# Altium schematic sheet Main.SchDoc
size C; SheetNumber: 1; SheetTotal: 1; SPICEModelCacheCWOFPNVQ: <root> / <DocumentId>CWOFPNVQ</DocumentId> / <CacheFrame Number="0"> / <Model Name="cap" Kind="MDL"> / <Text>*Default semiconductor capacitor / .MODEL CAP C()</Text> / </Model> / </CacheFrame> / </root>
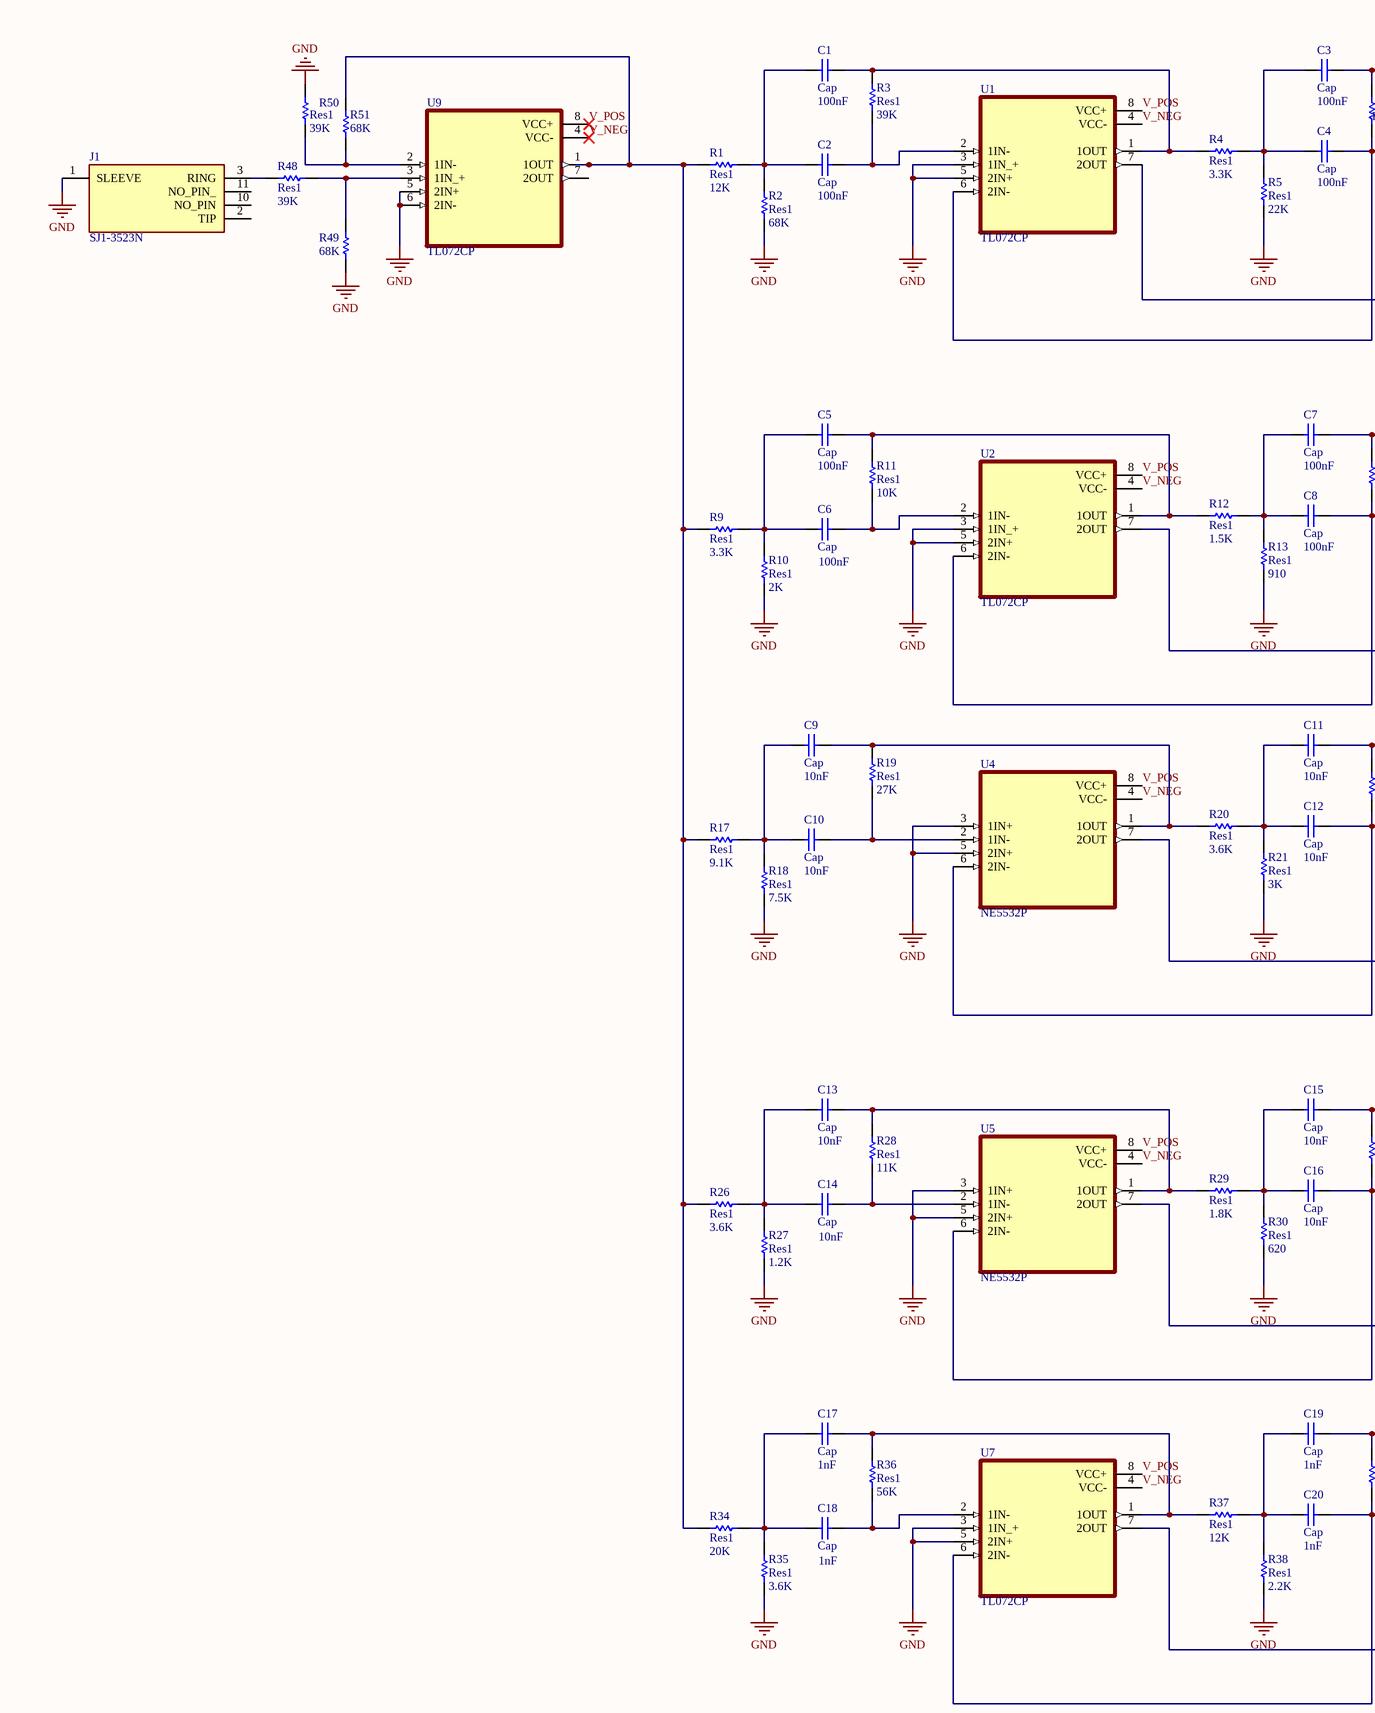
[diagram p0: Main.SchDoc, left]
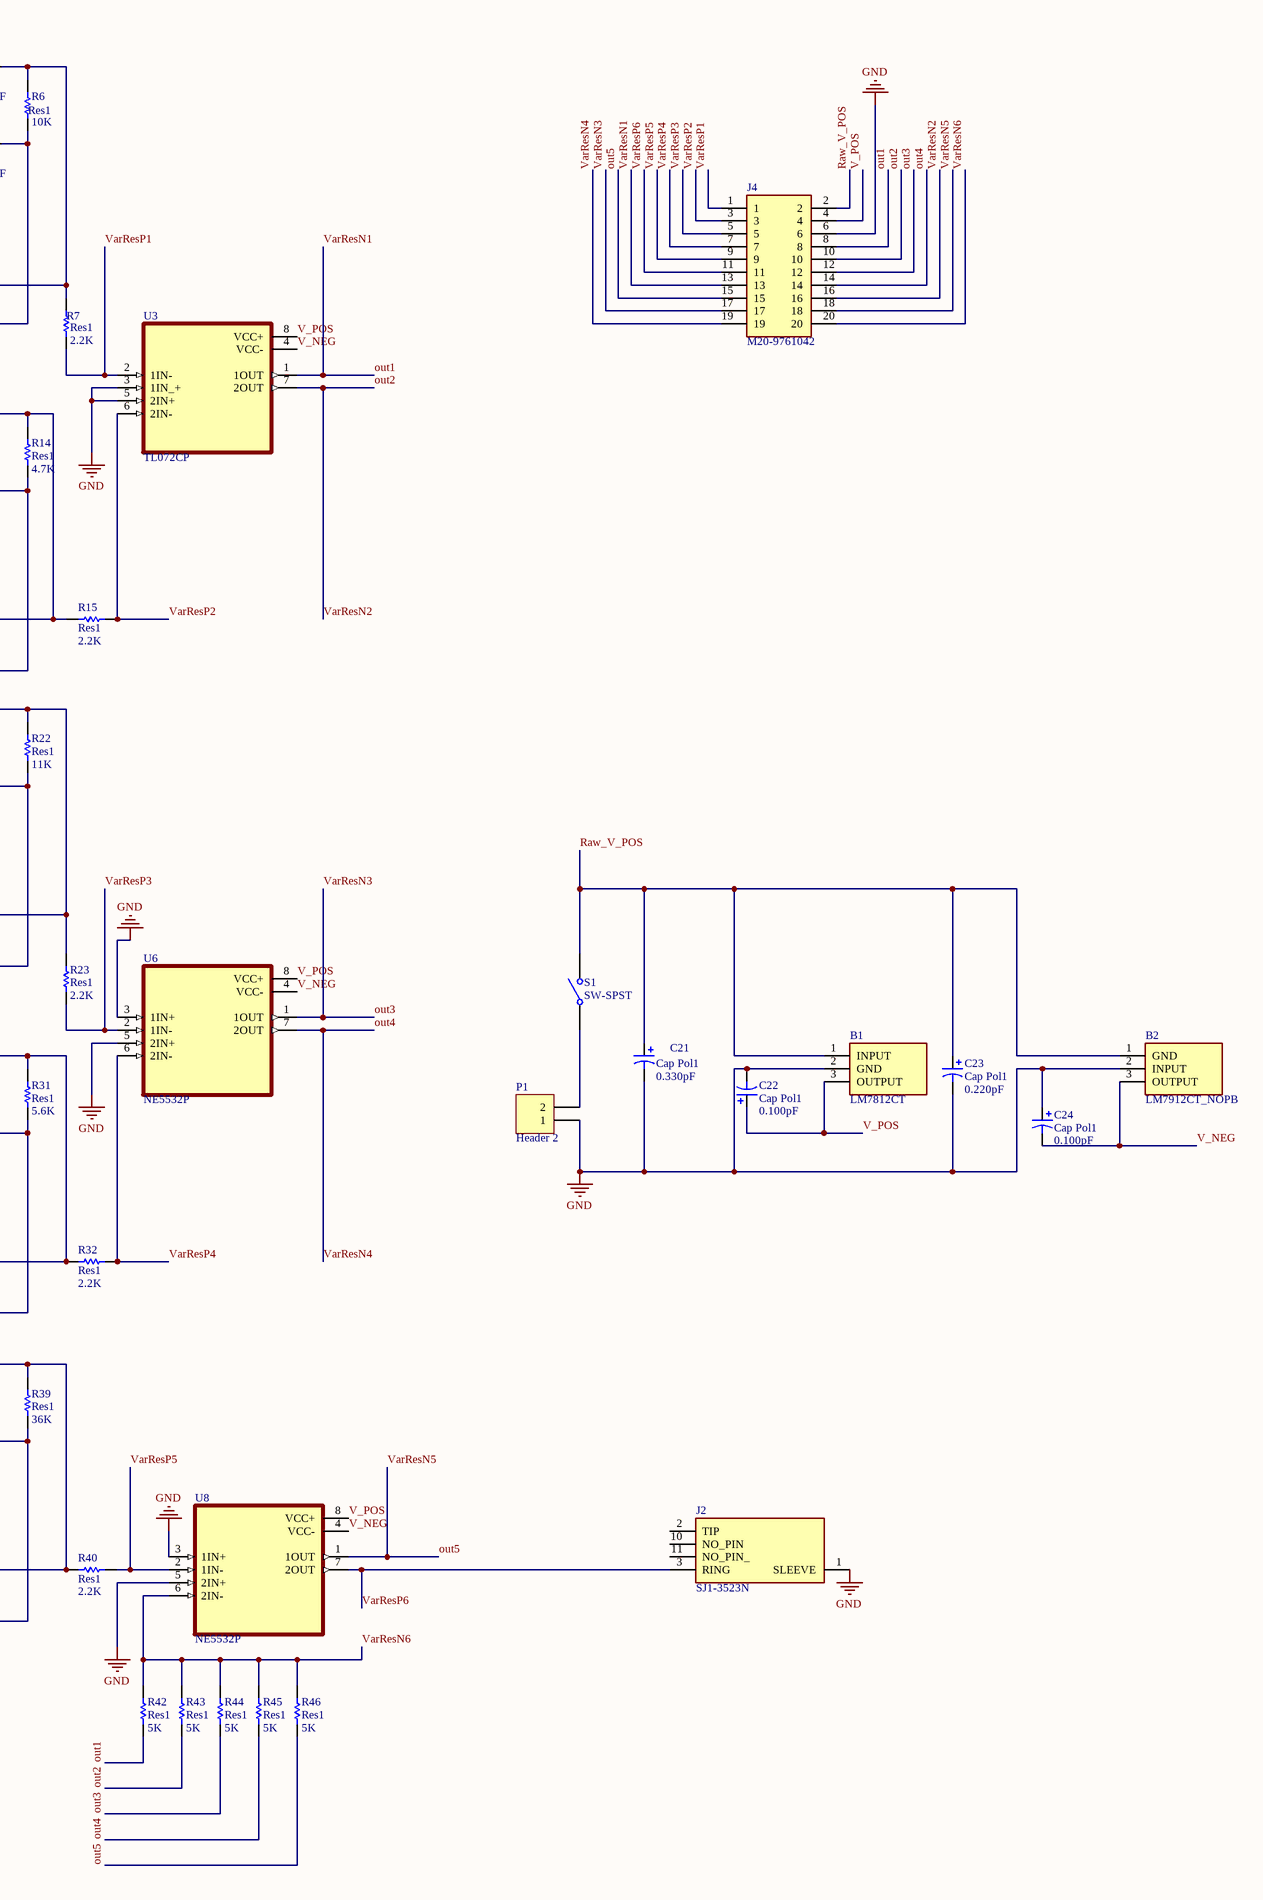
[diagram p1: Main.SchDoc, right]

## Parts
B1  LM7812CT  [TO254P470X1028X1955-3P]
B2  LM7912CT_NOPB  [TO254P470X1028X1955-3P]
C1  Cap  value 100nF  [RAD-0.3]
C2  Cap  value 100nF  [RAD-0.3]
C3  Cap  value 100nF  [RAD-0.3]
C4  Cap  value 100nF  [RAD-0.3]
C5  Cap  value 100nF  [RAD-0.3]
C6  Cap  value 100nF  [RAD-0.3]
C7  Cap  value 100nF  [RAD-0.3]
C8  Cap  value 100nF  [RAD-0.3]
C9  Cap  value 10nF  [RAD-0.3]
C10  Cap  value 10nF  [RAD-0.3]
C11  Cap  value 10nF  [RAD-0.3]
C12  Cap  value 10nF  [RAD-0.3]
C13  Cap  value 10nF  [RAD-0.3]
C14  Cap  value 10nF  [RAD-0.3]
C15  Cap  value 10nF  [RAD-0.3]
C16  Cap  value 10nF  [RAD-0.3]
C17  Cap  value 1nF  [RAD-0.3]
C18  Cap  value 1nF  [RAD-0.3]
C19  Cap  value 1nF  [RAD-0.3]
C20  Cap  value 1nF  [RAD-0.3]
C21  Cap Pol1  value 0.330pF  [RB7.6-15]
C22  Cap Pol1  value 0.100pF  [RB7.6-15]
C23  Cap Pol1  value 0.220pF  [RB7.6-15]
C24  Cap Pol1  value 0.100pF  [RB7.6-15]
J1  SJ1-3523N  [SJ13523N]
J2  SJ1-3523N  [SJ13523N]
J4  M20-9761042  [HDRV20W64P254_2X10_2540X508X838P]
P1  Header 2  [HDR1X2]
R1  Res1  value 12K  [AXIAL-0.3]
R2  Res1  value 68K  [AXIAL-0.3]
R3  Res1  value 39K  [AXIAL-0.3]
R4  Res1  value 3.3K  [AXIAL-0.3]
R5  Res1  value 22K  [AXIAL-0.3]
R6  Res1  value 10K  [AXIAL-0.3]
R7  Res1  value 2.2K  [AXIAL-0.3]
R9  Res1  value 3.3K  [AXIAL-0.3]
R10  Res1  value 2K  [AXIAL-0.3]
R11  Res1  value 10K  [AXIAL-0.3]
R12  Res1  value 1.5K  [AXIAL-0.3]
R13  Res1  value 910  [AXIAL-0.3]
R14  Res1  value 4.7K  [AXIAL-0.3]
R15  Res1  value 2.2K  [AXIAL-0.3]
R17  Res1  value 9.1K  [AXIAL-0.3]
R18  Res1  value 7.5K  [AXIAL-0.3]
R19  Res1  value 27K  [AXIAL-0.3]
R20  Res1  value 3.6K  [AXIAL-0.3]
R21  Res1  value 3K  [AXIAL-0.3]
R22  Res1  value 11K  [AXIAL-0.3]
R23  Res1  value 2.2K  [AXIAL-0.3]
R26  Res1  value 3.6K  [AXIAL-0.3]
R27  Res1  value 1.2K  [AXIAL-0.3]
R28  Res1  value 11K  [AXIAL-0.3]
R29  Res1  value 1.8K  [AXIAL-0.3]
R30  Res1  value 620  [AXIAL-0.3]
R31  Res1  value 5.6K  [AXIAL-0.3]
R32  Res1  value 2.2K  [AXIAL-0.3]
R34  Res1  value 20K  [AXIAL-0.3]
R35  Res1  value 3.6K  [AXIAL-0.3]
R36  Res1  value 56K  [AXIAL-0.3]
R37  Res1  value 12K  [AXIAL-0.3]
R38  Res1  value 2.2K  [AXIAL-0.3]
R39  Res1  value 36K  [AXIAL-0.3]
R40  Res1  value 2.2K  [AXIAL-0.3]
R42  Res1  value 5K  [AXIAL-0.3]
R43  Res1  value 5K  [AXIAL-0.3]
R44  Res1  value 5K  [AXIAL-0.3]
R45  Res1  value 5K  [AXIAL-0.3]
R46  Res1  value 5K  [AXIAL-0.3]
R48  Res1  value 39K  [AXIAL-0.3]
R49  value 68K  [AXIAL-0.3]  (hidden comment: Res1)
R50  Res1  value 39K  [AXIAL-0.3]
R51  value 68K  [AXIAL-0.3]  (hidden comment: Res1)
S1  SW-SPST  [SPST-2]
U1  TL072CP  [DIP794W45P254L959H508Q8]
U2  TL072CP  [DIP794W45P254L959H508Q8]
U3  TL072CP  [DIP794W45P254L959H508Q8]
U4  NE5532P  [DIP794W45P254L959H508Q8]
U5  NE5532P  [DIP794W45P254L959H508Q8]
U6  NE5532P  [DIP794W45P254L959H508Q8]
U7  TL072CP  [DIP794W45P254L959H508Q8]
U8  NE5532P  [DIP794W45P254L959H508Q8]
U9  TL072CP  [DIP794W45P254L959H508Q8]

## Nets
GND: B1.2(GND) B2.2(INPUT) C21.2 C22.2 C23.2 C24.1 J1.1(SLEEVE) J2.1(SLEEVE) J4.6 P1.1 R2.1 R5.1 R10.1 R13.1 R18.1 R21.1 R27.1 R30.1 R35.1 R38.1 R49.2 R50.2 U1.3(1IN_+) U1.5(2IN+) U2.3(1IN_+) U2.5(2IN+) U3.3(1IN_+) U3.5(2IN+) U4.3(1IN+) U4.5(2IN+) U5.3(1IN+) U5.5(2IN+) U6.3(1IN+) U6.5(2IN+) U7.3(1IN_+) U7.5(2IN+) U8.3(1IN+) U8.5(2IN+) U9.5(2IN+) U9.6(2IN-)
out1: J4.8 J4.13 R42.1 U3.1(1OUT)  [also labelled VarResN1]
out2: J4.10 J4.16 R43.1 U3.7(2OUT)  [also labelled VarResN2]
out3: J4.12 J4.17 R44.1 U6.1(1OUT)  [also labelled VarResN3]
out4: J4.14 J4.19 R45.1 U6.7(2OUT)  [also labelled VarResN4]
out5: J4.15 J4.18 R46.1 U8.1(1OUT)  [also labelled VarResN5]
Raw_V_POS: B1.1(INPUT) B2.1(GND) C21.1 C23.1 J4.2 S1.2(NO)
V_NEG: B2.3(OUTPUT) C24.2 U1.4(VCC-) U2.4(VCC-) U3.4(VCC-) U4.4(VCC-) U5.4(VCC-) U6.4(VCC-) U7.4(VCC-) U8.4(VCC-) U9.4(VCC-)
V_POS: B1.3(OUTPUT) C22.1 J4.4 U1.8(VCC+) U2.8(VCC+) U3.8(VCC+) U4.8(VCC+) U5.8(VCC+) U6.8(VCC+) U7.8(VCC+) U8.8(VCC+) U9.8(VCC+)
VarResN6: J4.20 R42.2 R43.2 R44.2 R45.2 R46.2 U8.6(2IN-)
VarResP1: J4.1 R7.1 U3.2(1IN-)
VarResP2: J4.3 R15.2 U3.6(2IN-)
VarResP3: J4.5 R23.1 U6.2(1IN-)
VarResP4: J4.7 R32.1 U6.6(2IN-)
VarResP5: J4.9 R40.1 U8.2(1IN-)
VarResP6: J2.3(RING) J4.11 U8.7(2OUT)
NetC1_1: C1.1 C2.1 R1.2 R2.2
NetC1_2: C1.2 R3.2 R4.1 U1.1(1OUT)
NetC2_2: C2.2 R3.1 U1.2(1IN-)
NetC3_1: C3.1 C4.1 R4.2 R5.2
NetC3_2: C3.2 R6.2 R7.2 U1.7(2OUT)
NetC4_2: C4.2 R6.1 U1.6(2IN-)
NetC5_1: C5.1 C6.1 R9.1 R10.2
NetC5_2: C5.2 R11.2 R12.2 U2.1(1OUT)
NetC6_2: C6.2 R11.1 U2.2(1IN-)
NetC7_1: C7.1 C8.1 R12.1 R13.2
NetC7_2: C7.2 R14.2 R15.1 U2.7(2OUT)
NetC8_2: C8.2 R14.1 U2.6(2IN-)
NetC9_1: C9.1 C10.1 R17.2 R18.2
NetC9_2: C9.2 R19.2 R20.1 U4.1(1OUT)
NetC10_2: C10.2 R19.1 U4.2(1IN-)
NetC11_1: C11.1 C12.1 R20.2 R21.2
NetC11_2: C11.2 R22.2 R23.2 U4.7(2OUT)
NetC12_2: C12.2 R22.1 U4.6(2IN-)
NetC13_1: C13.1 C14.1 R26.2 R27.2
NetC13_2: C13.2 R28.2 R29.1 U5.1(1OUT)
NetC14_2: C14.2 R28.1 U5.2(1IN-)
NetC15_1: C15.1 C16.1 R29.2 R30.2
NetC15_2: C15.2 R31.2 R32.2 U5.7(2OUT)
NetC16_2: C16.2 R31.1 U5.6(2IN-)
NetC17_1: C17.1 C18.1 R34.2 R35.2
NetC17_2: C17.2 R36.2 R37.1 U7.1(1OUT)
NetC18_2: C18.2 R36.1 U7.2(1IN-)
NetC19_1: C19.1 C20.1 R37.2 R38.2
NetC19_2: C19.2 R39.1 R40.2 U7.7(2OUT)
NetC20_2: C20.2 R39.2 U7.6(2IN-)
NetJ1_3: J1.3(RING) R48.1
NetP1_2: P1.2 S1.1(COMMON)
NetR1_1: R1.1 R9.2 R17.1 R26.1 R34.1 R51.2 U9.1(1OUT)
NetR48_2: R48.2 R49.1 U9.3(1IN_+)
NetR50_1: R50.1 R51.1 U9.2(1IN-)

Not connected (* = marked no-connect by the designer): J1 2(TIP) 10(NO_PIN) 11(NO_PIN_); J2 2(TIP) 10(NO_PIN) 11(NO_PIN_); U9 7(2OUT)

## Library data of the parts
B1 = LM7812CT: TO220 voltage regulator,LM7812CT 12V 1A; Manufacturer_Name: Texas Instruments; Geometry.Height: 4.7mm; Manufacturer_Part_Number: LM7812CT; Mouser Part Number: 926-LM7812CT; Mouser Price/Stock: https://www.mouser.co.uk/ProductDetail/Texas-Instruments/LM7812CT?qs=QbsRYf82W3EQj7KGft8TFg%3D%3D; Arrow Part Number: *; Arrow Price/Stock: *; Mouser Testing Part Number: *; Mouser Testing Price/Stock: *; Datasheet Link: http://www.ti.com/lit/ds/symlink/lm7800.pdf
B2 = LM7912CT_NOPB: Texas Instruments LM7912CT/NOPB, Single Negative Voltage Regulator 1.5A -12 V, +/-4%, 3-Pin TO-220; Geometry.Height: 4.7mm; Manufacturer_Name: Texas Instruments; Manufacturer_Part_Number: LM7912CT/NOPB; Mouser Part Number: 926-LM7912CT/NOPB; Mouser Price/Stock: https://www.mouser.co.uk/ProductDetail/Texas-Instruments/LM7912CT-NOPB?qs=QbsRYf82W3GCP0%2FQjKEJfQ%3D%3D; Arrow Part Number: LM7912CT/NOPB; Arrow Price/Stock: https://www.arrow.com/en/products/lm7912ctnopb/texas-instruments?region=nac; Mouser Testing Part Number: *; Mouser Testing Price/Stock: *; Datasheet Link: http://www.ti.com/lit/gpn/lm79
C1-C20 = Cap: Capacitor; Published: 8-Jun-2000; LatestRevisionDate: 17-Jul-2002; LatestRevisionNote: Re-released for DXP Platform.; PackageReference: RAD-0.3; Publisher: Altium Limited; PackageDescription: Radial Cap, Thru-Hole; 2 Leads; 0.3 in Pin Spacing
C21-C24 = Cap Pol1: Polarized Capacitor (Radial); Published: 8-Jun-2000; LatestRevisionDate: 17-Jul-2002; LatestRevisionNote: Re-released for DXP Platform.; PackageReference: RB7.6-15; Publisher: Altium Limited; PackageDescription: Polarized Capacitor (Radial); 2 Leads
J1 J2 = SJ1-3523N: Phone Connectors 3.5 MM AUDIO JACK; Manufacturer_Name: CUI Devices; Geometry.Height: 5.5mm; Manufacturer_Part_Number: SJ1-3523N; Mouser Part Number: 490-SJ1-3523N; Mouser Price/Stock: https://www.mouser.co.uk/ProductDetail/CUI-Devices/SJ1-3523N?qs=WyjlAZoYn50aNl0vAhb3Tg%3D%3D; Arrow Part Number: SJ1-3523N; Arrow Price/Stock: https://www.arrow.com/en/products/sj1-3523n/cui-devices?region=nac; Mouser Testing Part Number: *; Mouser Testing Price/Stock: *; Datasheet Link: https://componentsearchengine.com/Datasheets/1/SJ1-3523N.pdf
J4 = M20-9761042: Headers & Wire Housings 10+10 DIL VERTICAL PIN HEADER GOLD+TIN; Manufacturer_Name: Harwin; Geometry.Height: 8.38mm; Manufacturer_Part_Number: M20-9761042; Mouser Part Number: 855-M20-9761042; Mouser Price/Stock: https://www.mouser.co.uk/ProductDetail/Harwin/M20-9761042?qs=vF78I%252BjhbY%2Fp44UYNx369Q%3D%3D; Arrow Part Number: *; Arrow Price/Stock: *; Mouser Testing Part Number: *; Mouser Testing Price/Stock: *; Datasheet Link: https://cdn.harwin.com/pdfs/M20-976.pdf
P1 = Header 2: Header, 2-Pin; LatestRevisionDate: 17-Jul-2002; LatestRevisionNote: Re-released for DXP Platform.; Publisher: Altium Limited
R1-R7 R9-R15 R17-R23 R26-R32 R34-R40 R42-R46 R48-R51 = Res1: Resistor; Published: 8-Jun-2000; LatestRevisionDate: 17-Jul-2002; LatestRevisionNote: Re-released for DXP Platform.; PackageReference: AXIAL-0.3; Publisher: Altium Limited; PackageDescription: Axial Device, Thru-Hole; 2 Leads; 0.3 in Pin Spacing
S1 = SW-SPST: Single-Pole, Single-Throw Switch; Published: 24-Mar-1999; LatestRevisionDate: 17-Jul-2002; LatestRevisionNote: Re-released for DXP Platform.; PackageReference: SPST-2; Publisher: Altium Limited; PackageDescription: Switch; 2 Leads
U1-U3 U7 U9 = TL072CP: Dual Low-Noise JFET-Input General-Purpose Operational Amplifier; MF: Texas Instruments; Value: *; SnapEDA_Link: https://www.snapeda.com/parts/TL072CP/Texas%20Instruments/view-part/2181721/?ref=snap; Texas_Instruments-Purchase-URL: https://snapeda.com/shop?store=Texas+Instruments&id=2181721; Mouser-Purchase-URL: https://snapeda.com/shop?store=Mouser&id=2181721; Availability: Unavailable; Price: None; Package: PDIP-8 Texas Instruments; DigiKey-Purchase-URL: https://snapeda.com/shop?store=DigiKey&id=2181721; MP: TL072CP
U4-U6 U8 = NE5532P: Dual Low-Noise High-Speed Audio Operational Amplifier 8-PDIP 0 to 70; MF: Texas Instruments; Value: *; Price: None; Package: PDIP-8 Texas; SnapEDA_Link: https://www.snapeda.com/parts/NE5532P/Texas%20Instruments/view-part/9039/?ref=snap; Availability: Good; Purchase-URL: https://pricing.snapeda.com/search/part/NE5532P/?ref=eda; MP: NE5532P; Check_prices: https://www.snapeda.com/parts/NE5532P/Texas%20Instruments/view-part/9039/?ref=eda